# EAGLE design spider_tx5 (EAGLE 6.5.0)
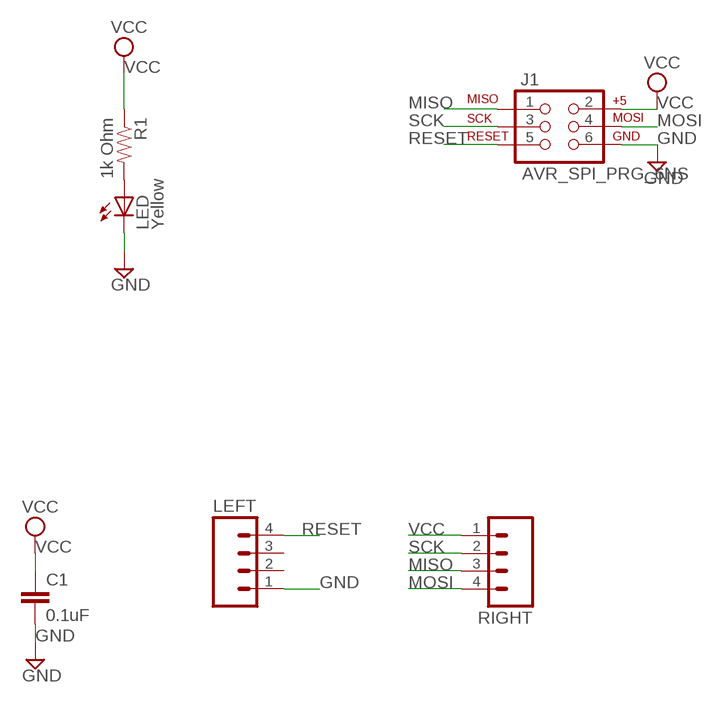
[diagram p0: schematic, sheet 1]

## Parts
C1  0.1uF  CAP1206  [1206]
J1  AVR_SPI_PRG_6NS  [2X3-NS]
LED  Yellow  LED-YELLOWLILYPAD  [LED-1206]
LEFT  M04PTH  [1X04]
R1  1k Ohm  RESISTOR1206  [1206]
RIGHT  M04PTH  [1X04]

## Nets
GND: C1.2 J1.6 LED.C LEFT.1
MISO: J1.1 RIGHT.3
MOSI: J1.4 RIGHT.4
N$14: LED.A R1.2
RESET: J1.5 LEFT.4
SCK: J1.3 RIGHT.2
VCC: C1.1 J1.2 R1.1 RIGHT.1
Unconnected: LEFT.2 LEFT.3

## Library data of the parts
C1 = SparkFun-Passives:CAP: Capacitor Standard 0603 ceramic capacitor, and 0.1" leaded capacitor.
J1 = SparkFun-Connectors:AVR_SPI_PRG_6: AVR ISP 6 Pin This is the reduced ISP connector for AVR programming. Common on Arduino. This footprint will take up less PCB space and can be used with a 10-pin to 6-pin adapter such as SKU: BOB-08508
LED = SparkFun-LED:LED-YELLOW: Yellow SMD LEDs LilyPad 1206- DIO-09909 0603- DIO-09003; PROD_ID: DIO-09909
LEFT RIGHT = SparkFun-Connectors:M04: Header 4 Standard 4-pin 0.1" header. Use with straight break away headers (SKU : PRT-00116), right angle break away headers (PRT-00553), swiss pins (PRT-00743), machine pins (PRT-00117), and female headers (PRT-00115). Molex polarized connector foot print use with SKU : PRT-08231 with associated crimp pins and housings. 1MM SMD Version SKU: PRT-10208
R1 = SparkFun-Passives:RESISTOR: Resistor Basic schematic elements and footprints for 0603, 1206, and PTH resistors.

## Board
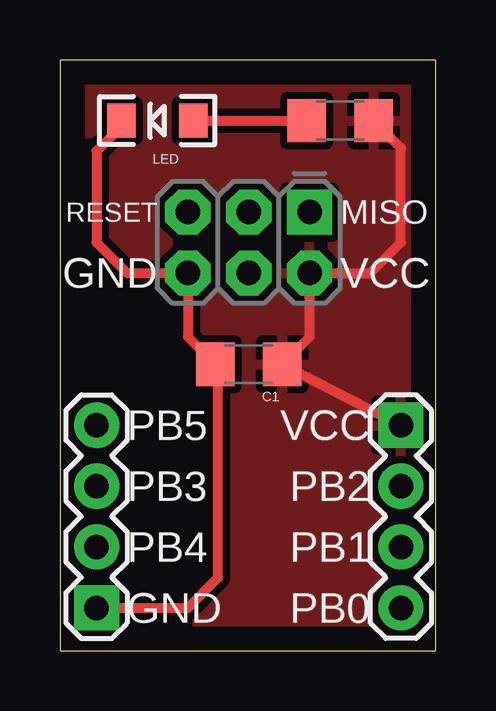
[diagram p1: board, top side]
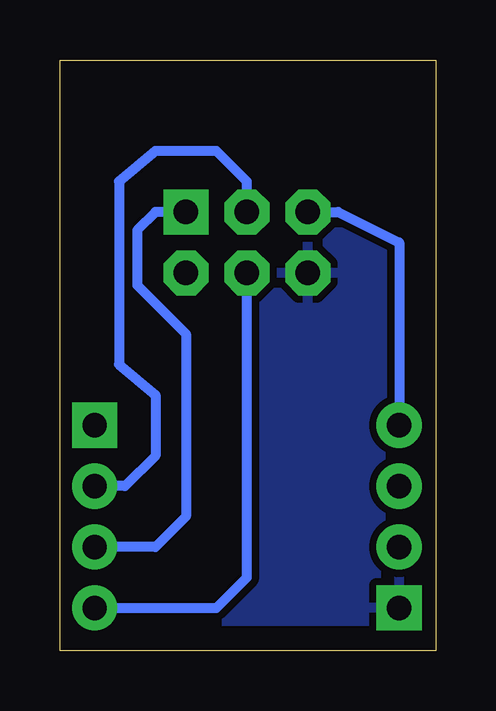
[diagram p2: board, bottom side, seen from below]

Size 15.67 x 24.63 mm. Coordinates in mm from the lower left corner, seen from the top.
Outline: 0,0 15.67,0 15.67,24.63 0,24.63 0,0
Copper layers (1*16): Top 0.035mm / dielectric 1.5mm / Bottom 0.035mm
Design rules "improved_12mil": minimum track width 12mil, minimum drill 0.8mm, track to track 12mil, track to pad 12mil, pad to pad 12mil, via to via 12mil, smd to smd 12mil, copper to edge 40mil, drill to drill 12mil, minimum pad ring 16mil, minimum via ring 16mil, stop-mask expansion 4mil, vias tented up to drill 0mil, thermal gap 12mil

### Footprints (pad centres in the part's own frame; a part is rotated, then mirrored left to right if it is on the bottom)
1206 = smd 1.6 x 1.8: 1 -1.4,0; 2 1.4,0
2X3-NS = drill 1.016 pad 1.88 square: 1 -2.54,-1.27 | drill 1.016 pad 1.88 octagon: 2 -2.54,1.27; 3 0,-1.27; 4 0,1.27; 5 2.54,-1.27; 6 2.54,1.27
LED-1206 = smd 1.2 x 1.4: A -1.5,0; C 1.5,0
1X04 = drill 1.016 pad 1.88 square: 1 0,0 | drill 1.016 pad 1.88: 2 2.54,0; 3 5.08,0; 4 7.62,0

### Placement (x,y rotation side)
C1  7.87,11.94 180 top
J1  7.87,17.02 180 top
LED  4.06,22.1 180 top
LEFT  1.52,1.78 90 top
R1  11.68,22.1 180 top
RIGHT  14.22,9.4 270 top

### Tracks (layer width: path | path; a pad name or v marks a point on that pad's centre or on a via)
GND
  Top 0.406: LED.C 2.56,21.87 1.52,20.83 1.52,17.02 2.79,15.75 J1.6 5.33,13.08 C1.2 6.6,11.81 6.6,3.05 5.33,1.78 LEFT.1
  pour Bottom: 0.25,24.64 0.25,0.51 15.49,0.51 15.49,24.64
MISO
  Bottom 0.406: J1.1 11.68,18.29 12.45,17.53 12.45,15.24 10.41,13.21 10.41,5.59 11.68,4.32 RIGHT.3
MOSI
  Bottom 0.406: RIGHT.4 9.14,1.78 7.87,3.05 J1.4
N$14
  Top 0.406: LED.A R1.2
RESET
  Bottom 0.406: J1.5 4.06,18.29 1.52,17.02 LEFT.4
SCK
  Bottom 0.406: J1.3 7.87,19.56 9.14,20.83 11.68,20.83 13.21,19.56 13.21,11.94 11.68,10.67 11.68,8.13 12.95,6.86 RIGHT.2
VCC
  Top 0.406: RIGHT.1 C1.1 10.41,13.08 J1.2 12.95,15.75 14.22,17.02 14.22,20.96 R1.1
  pour Top: 0.25,24.64 0.25,0.51 15.49,0.51 15.49,24.64

### Text on the board
tNames: RESET | MISO | GND | VCC | PB5 | VCC | PB3 | PB2 | PB4 | PB1 | GND | PB0